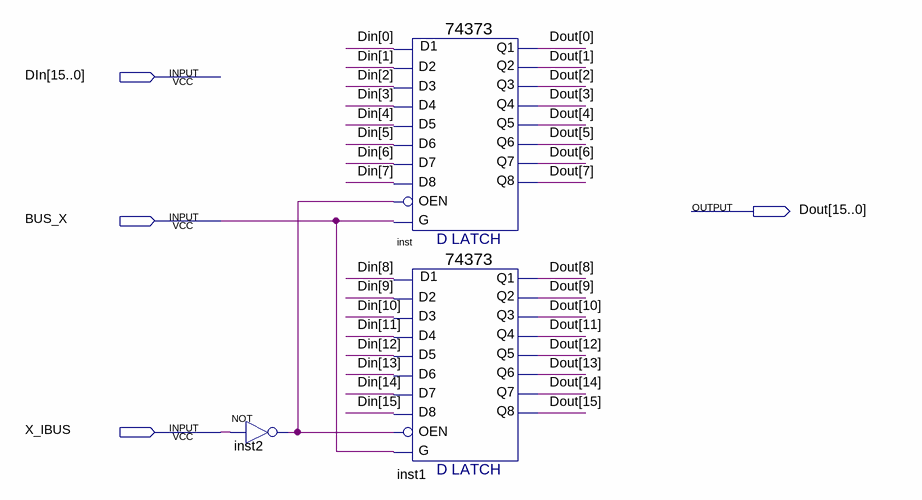
[diagram p0: schematic sheet]
// Quartus schematic X_IBUS.bdf as structural Verilog: 3 symbols, 4 pins
module X_IBUS (
  input  [15:0] DIn,
  input  BUS_X,
  input  X_IBUS,
  output [15:0] Dout
);

  wire inst2_out;

  not inst2 (inst2_out, X_IBUS);
  \74373  inst (
    .D1(DIn[0]), .D3(DIn[2]), .D6(DIn[5]), .D7(DIn[6]), .D2(DIn[1]), .G(BUS_X), .D4(DIn[3]), .D5(DIn[4]),
    .D8(DIn[7]), .OEN(inst2_out), .Q3(Dout[2]), .Q6(Dout[5]), .Q7(Dout[6]), .Q2(Dout[1]), .Q8(Dout[7]),
    .Q4(Dout[3]), .Q5(Dout[4]), .Q1(Dout[0]));
  \74373  inst1 (
    .D1(DIn[8]), .D3(DIn[10]), .D6(DIn[13]), .D7(DIn[14]), .D2(DIn[9]), .G(BUS_X), .D4(DIn[11]),
    .D5(DIn[12]), .D8(DIn[15]), .OEN(inst2_out), .Q3(Dout[10]), .Q6(Dout[13]), .Q7(Dout[14]), .Q2(Dout[9]),
    .Q8(Dout[15]), .Q4(Dout[11]), .Q5(Dout[12]), .Q1(Dout[8]));
endmodule
